# EAGLE schematic hbridge (EAGLE 8.1.0)
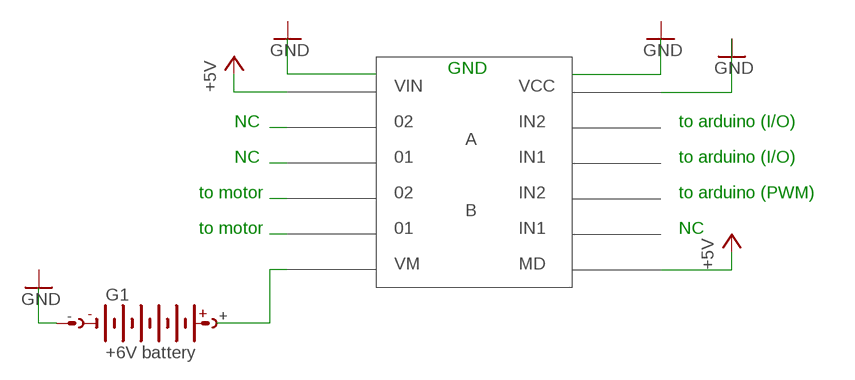
[diagram p0: schematic, sheet 1]

## Parts
G1  +6V battery  AB9V  [AB9V]

## Nets
N$7: G1.-
Unconnected: G1.+

## Notes on the sheet
- GND
- VIN | VCC
- NC | 02 | IN2 | to arduino (I/O)
- A
- NC | 01 | IN1 | to arduino (I/O)
- to motor | 02 | IN2 | to arduino (PWM)
- B
- to motor | 01 | IN1 | NC
- VM | MD

## Library data of the parts
G1 = battery:AB9V: 9-V BATTERY CLIP